# Altium project ATmega328_v2.1.PrjPcb
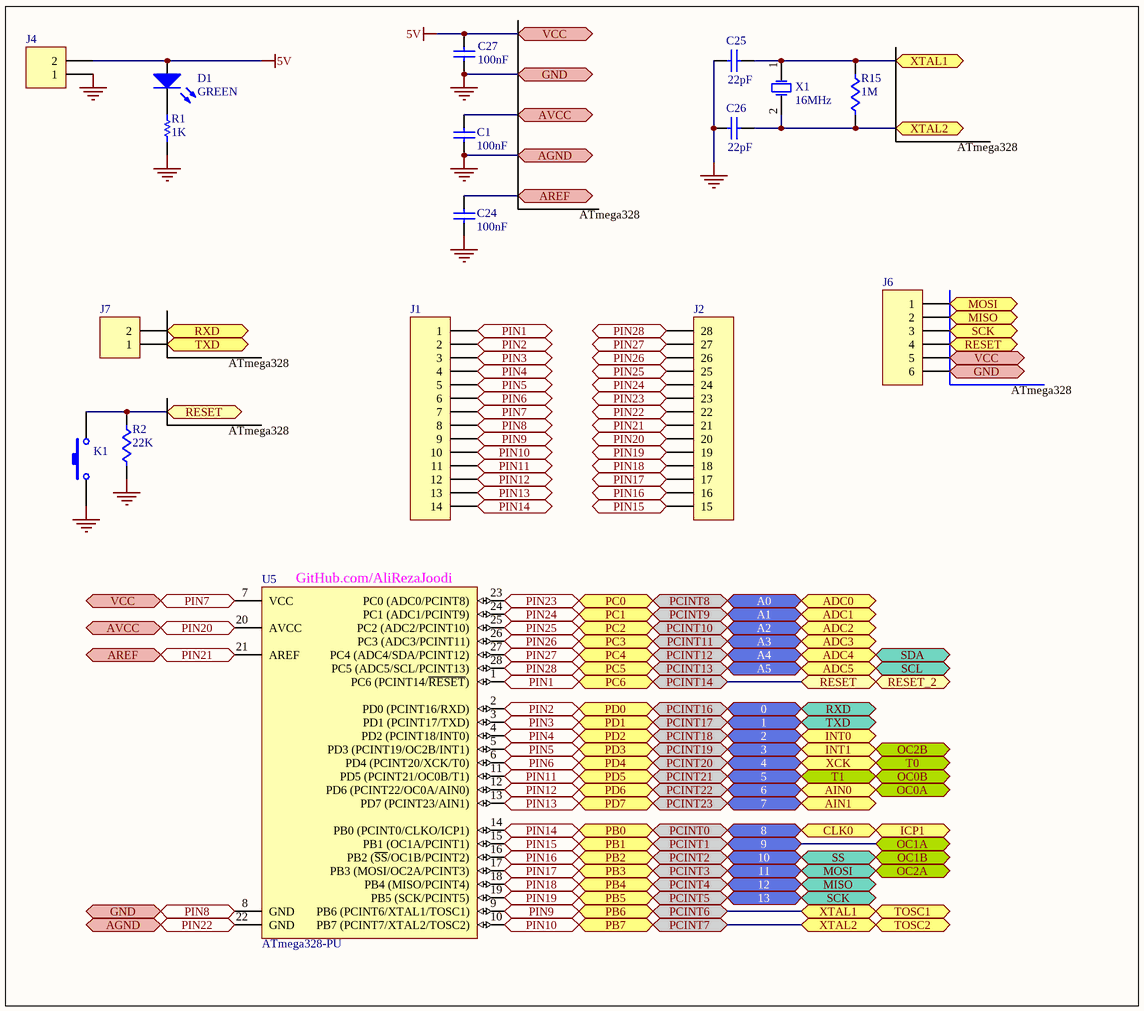
[diagram p0: Main.SchDoc]
1 sheet, 17 parts. Net scope: flat (ports and power ports of the same name join across sheets).
Board file: PCB.PcbDoc

## Sheet Main.SchDoc
size 213 x 187 mm

### Parts
C1  100nF  [SMD_0805]
C24  100nF  [0805]
C25  22pF  [0805]
C26  22pF  [0805]
C27  100nF  [SMD_0805]
D1  GREEN  [LED-5mm_Red]
J1  Header 14  [HDR1X14]  (value not drawn)
J2  14PIN  [HDR1X14_2]  (value not drawn)
J4  2PIN  [HDR1X2]  (value not drawn)
J6  6PIN  [HDR1X6]  (value not drawn)
J7  2PIN  [HDR1X2]  (value not drawn)
K1  SW-PB  [SPST-2_2]  (value not drawn)
R1  1K  [0805]
R2  22K  [0805]
R15  1M  [0805]
U5  ATmega328-PU  [28P3]
X1  16MHz  [XTAL_2]

### Ports
0 (bidir), 1 (bidir), 2 (bidir), 3 (bidir), 4 (bidir), 5 (bidir), 6 (bidir), 7 (bidir), 8 (bidir), 9 (bidir), 10 (bidir), 11 (bidir), 12 (bidir), 13 (bidir), A0 (bidir), A1 (bidir), A2 (bidir), A3 (bidir), A4 (bidir), A5 (bidir), ADC0 (bidir), ADC1 (bidir), ADC2 (bidir), ADC3 (bidir), ADC4 (bidir), ADC5 (bidir), AGND, AIN0 (bidir), AIN1 (bidir), AREF, AVCC, CLK0 (bidir), GND, ICP1 (bidir), INT0 (bidir), INT1 (bidir), MISO, MISO (bidir), MOSI, MOSI (bidir), OC0A (bidir), OC0B (bidir), OC1A (bidir), OC1B (bidir), OC2A (bidir), OC2B (bidir), PB0 (bidir), PB1 (bidir), PB2 (bidir), PB3 (bidir), PB4 (bidir), PB5 (bidir), PB6, PB7, PC0 (bidir), PC1 (bidir), PC2 (bidir), PC3 (bidir), PC4 (bidir), PC5 (bidir), PC6 (bidir), PCINT0 (bidir), PCINT1 (bidir), PCINT2 (bidir), PCINT3 (bidir), PCINT4 (bidir), PCINT5 (bidir), PCINT6, PCINT7, PCINT8 (bidir), PCINT9 (bidir), PCINT10 (bidir), PCINT11 (bidir), PCINT12 (bidir), PCINT13 (bidir), PCINT14 (bidir), PCINT16 (bidir), PCINT17 (bidir), PCINT18 (bidir), PCINT19 (bidir), PCINT20 (bidir), PCINT21 (bidir), PCINT22 (bidir), PCINT23 (bidir), PD0 (bidir), PD1 (bidir), PD2 (bidir), PD3 (bidir), PD4 (bidir), PD5 (bidir), PD6 (bidir), PD7 (bidir), PIN1, PIN2, PIN3, PIN4, PIN5, PIN6, PIN7, PIN8, PIN9, PIN10, PIN11, PIN12, PIN13, PIN14, PIN15, PIN16, PIN17, PIN18, PIN19, PIN20, PIN21, PIN22, PIN23, PIN24, PIN25, PIN26, PIN27, PIN28, RESET, RESET (bidir), RESET_2 (bidir), RXD, RXD (bidir), SCK, SCK (bidir), SCL (bidir), SDA (bidir), SS (bidir), T0 (bidir), T1 (bidir), TOSC1, TOSC2, TXD, TXD (bidir), VCC, XCK (bidir), XTAL1, XTAL2

### Nets
5V: C27.2 D1.1(A) J1.7 J4.2 J6.5 U5.7(VCC) ; port VCC, port PIN7
GND: C1.1 C24.1 C25.2 C26.2 C27.1 J1.8 J2.22 J4.1 J6.6 K1.1 R1.2 R2.1 U5.8(GND) U5.22(GND) ; port GND, port AGND, port PIN8, port PIN22
NetC1_2: C1.2 J2.20 U5.20(AVCC) ; port AVCC, port PIN20
NetC24_2: C24.2 J2.21 U5.21(AREF) ; port AREF, port PIN21
NetC25_1: C25.1 J1.9 R15.2 U5.9(PB6_(PCINT6/XTAL1/TOSC1)) X1.1(OSC1) ; port XTAL1, port TOSC1, port PB6, port PCINT6, port PIN9
NetC26_1: C26.1 J1.10 R15.1 U5.10(PB7_(PCINT7/XTAL2/TOSC2)) X1.2(OSC2) ; port XTAL2, port TOSC2, port PB7, port PCINT7, port PIN10
NetD1_2: D1.2(K) R1.1
NetJ1_1: J1.1 J6.4 K1.2 R2.2 U5.1(PC6_(PCINT14/~{RESET})) ; port RESET, port PC6, port PCINT14, port RESET_2, port PIN1
NetJ1_2: J1.2 J7.2 U5.2(PD0_(PCINT16/RXD)) ; port RXD, port PD0, port PCINT16, port 0, port PIN2
NetJ1_3: J1.3 J7.1 U5.3(PD1_(PCINT17/TXD)) ; port TXD, port PD1, port PCINT17, port 1, port PIN3
NetJ1_4: J1.4 U5.4(PD2_(PCINT18/INT0)) ; port PD2, port PCINT18, port INT0, port 2, port PIN4
NetJ1_5: J1.5 U5.5(PD3_(PCINT19/OC2B/INT1)) ; port PD3, port PCINT19, port INT1, port OC2B, port 3, port PIN5
NetJ1_6: J1.6 U5.6(PD4_(PCINT20/XCK/T0)) ; port PD4, port PCINT20, port XCK, port T0, port 4, port PIN6
NetJ1_11: J1.11 U5.11(PD5_(PCINT21/OC0B/T1)) ; port PD5, port PCINT21, port T1, port OC0B, port 5, port PIN11
NetJ1_12: J1.12 U5.12(PD6_(PCINT22/OC0A/AIN0)) ; port PD6, port PCINT22, port AIN0, port OC0A, port 6, port PIN12
NetJ1_13: J1.13 U5.13(PD7_(PCINT23/AIN1)) ; port PD7, port PCINT23, port AIN1, port 7, port PIN13
NetJ1_14: J1.14 U5.14(PB0_(PCINT0/CLKO/ICP1)) ; port PB0, port PCINT0, port CLK0, port ICP1, port 8, port PIN14
NetJ2_15: J2.15 U5.15(PB1_(OC1A/PCINT1)) ; port PB1, port PCINT1, port OC1A, port 9, port PIN15
NetJ2_16: J2.16 U5.16(PB2_(~{SS}/OC1B/PCINT2)) ; port PB2, port PCINT2, port OC1B, port SS, port 10, port PIN16
NetJ2_17: J2.17 J6.1 U5.17(PB3_(MOSI/OC2A/PCINT3)) ; port MOSI, port PB3, port PCINT3, port OC2A, port 11, port PIN17
NetJ2_18: J2.18 J6.2 U5.18(PB4_(MISO/PCINT4)) ; port MISO, port PB4, port PCINT4, port 12, port PIN18
NetJ2_19: J2.19 J6.3 U5.19(PB5_(SCK/PCINT5)) ; port SCK, port PB5, port PCINT5, port 13, port PIN19
NetJ2_23: J2.23 U5.23(PC0_(ADC0/PCINT8)) ; port ADC0, port PC0, port PCINT8, port A0, port PIN23
NetJ2_24: J2.24 U5.24(PC1_(ADC1/PCINT9)) ; port ADC1, port PC1, port PCINT9, port A1, port PIN24
NetJ2_25: J2.25 U5.25(PC2_(ADC2/PCINT10)) ; port ADC2, port PC2, port PCINT10, port A2, port PIN25
NetJ2_26: J2.26 U5.26(PC3_(ADC3/PCINT11)) ; port ADC3, port PC3, port PCINT11, port A3, port PIN26
NetJ2_27: J2.27 U5.27(PC4_(ADC4/SDA/PCINT12)) ; port SDA, port ADC4, port PC4, port PCINT12, port A4, port PIN27
NetJ2_28: J2.28 U5.28(PC5_(ADC5/SCL/PCINT13)) ; port SCL, port ADC5, port PC5, port PCINT13, port A5, port PIN28

### Notes on the sheet
- (near R15) ATmega328
- ATmega328
- (near J7) ATmega328
- (near J6) ATmega328
- (near R2) ATmega328
- (near U5) GitHub.com/AliRezaJoodi

### Library data of the parts
C1 C24-C27 = Cap: Capacitor; Manufacturer: Generic Components; Class I: Passive; Published: 8-Jun-2000; Revision: July-2002: Re-released for DXP Platform.; Publisher: Altium Limited; Class II: Capacitor
D1 = LED: Typical INFRARED GaAs LED; Manufacturer: Generic Components; Class I: Optoelectronic; Published: 8-Jun-2000; Revision: July-2002: Re-released for DXP Platform.; Publisher: Altium Limited; Class II: LED
J1 = Header 14: Header, 14-Pin; Manufacturer: Generic Components; Class I: Connector; Revision: July-2002: Re-released for DXP Platform.; Publisher: Altium Limited
J2 = Header 14_2: Header, 14-Pin; Manufacturer: Generic Components; Class I: Connector; Revision: July-2002: Re-released for DXP Platform.; Publisher: Altium Limited
J4 J7 = Header 2: Header, 2-Pin; Manufacturer: Generic Components; Class I: Connector; Revision: July-2002: Re-released for DXP Platform.; Publisher: Altium Limited
J6 = Header 6: Header, 6-Pin; LatestRevisionDate: 17-Jul-2002; LatestRevisionNote: Re-released for DXP Platform.; Publisher: Altium Limited
K1 = SW-PB: Switch; Manufacturer: Generic Components; Published: 24-Mar-1999; Revision: July-2002: Re-released for DXP Platform.; Publisher: Altium Limited
R1 = Res1: Resistor; Published: 8-Jun-2000; LatestRevisionDate: 17-Jul-2002; LatestRevisionNote: Re-released for DXP Platform.; PackageReference: AXIAL-0.3; Publisher: Altium Limited
R2 R15 = Res1: Resistor; Manufacturer: Generic Components; Class I: Passive; Published: 8-Jun-2000; Revision: July-2002: Re-released for DXP Platform.; Publisher: Altium Limited; Class II: Resistor
U5 = ATmega328-PU: 8-bit AVR Microcontroller, 32KB Flash, 1KB EEPROM, 2KB SRAM, 28-pin PDIP, Industrial Grade (-40°C to 85°C); Published: 1-Apr-2010; DatasheetVersion: revA, Jan-2010; PackageVersion: revB, Sep-2001; PackageReference: 28P3; Publisher: Altium Limited; PackageDescription: 28-lead (0.300"/7.62mm Wide) Plastic Dual Inline Package (PDIP); Supplier 1: Digi-Key; Supplier Part Number 1: ATMEGA328-PU-ND; Supplier 2: Mouser; Supplier Part Number 2: 556-ATMEGA328-PU; ComponentLink1Description: Manufacturer Link; ComponentLink1URL: http://www.atmel.com/products/avr/default.asp?; ComponentLink2Description: ATmega48A/48PA/88A/88PA/168A/168PA/328/328P Datasheet; ComponentLink2URL: http://www.atmel.com/dyn/resources/prod_documents/8271.pdf; ComponentLink3Description: ATmega48A/48PA/88A/88PA/168A/168PA/328/328P Summary; ComponentLink3URL: http://www.atmel.com/dyn/resources/prod_documents/8271S.pdf; ComponentLink4Description: Atmel.com Home; ComponentLink4URL: http://www.atmel.com
X1 = XTAL: Crystal Oscillator; Manufacturer: Generic Components; Published: 8-Jun-2000; Revision: July-2002: Re-released for DXP Platform.; Publisher: Altium Limited; Class I: Oscillator; Class II: Crystal Oscillator